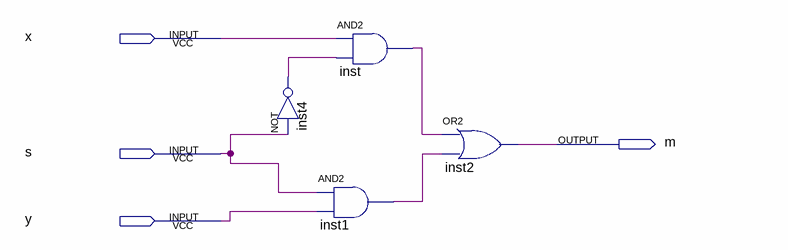
[diagram p0: schematic sheet]
// Quartus schematic week3.bdf as structural Verilog: 4 symbols, 4 pins
module week3 (
  input  x,
  input  s,
  input  y,
  output m
);

  wire inst1_out, inst4_out, inst_out;

  not inst4 (inst4_out, s);
  and inst1 (inst1_out, s, y);
  and inst (inst_out, x, inst4_out);
  or inst2 (m, inst_out, inst1_out);
endmodule
